# Altium schematic sheet MCU_CAN.SchDoc
size A4
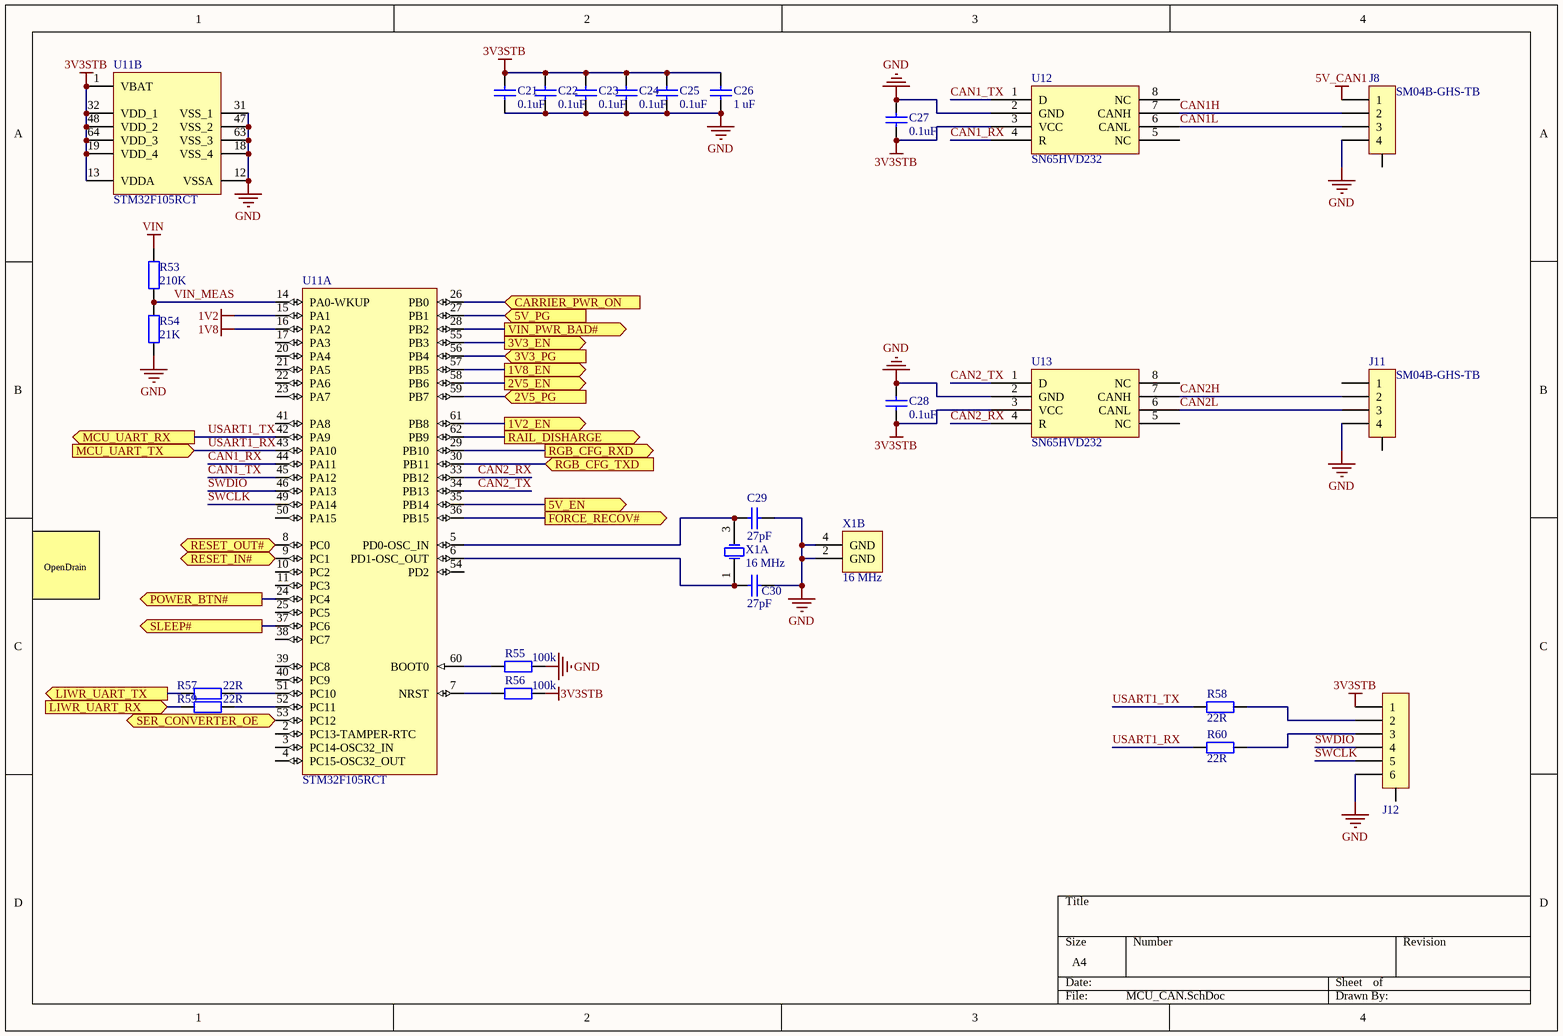
[diagram p0: MCU_CAN.SchDoc]

## Parts
C21  Capacitance: 0.1uF  [0402C_M]  (hidden comment: GRM155R71C104KA88D)
C22  Capacitance: 0.1uF  [0402C_M]  (hidden comment: GRM155R71C104KA88D)
C23  Capacitance: 0.1uF  [0402C_M]  (hidden comment: GRM155R71C104KA88D)
C24  Capacitance: 0.1uF  [0402C_M]  (hidden comment: GRM155R71C104KA88D)
C25  Capacitance: 0.1uF  [0402C_M]  (hidden comment: GRM155R71C104KA88D)
C26  Capacitance: 1 uF  [0603C_M]  (hidden comment: GRM188R61A105KA61D)
C27  Capacitance: 0.1uF  [0402C_M]  (hidden comment: GRM155R71C104KA88D)
C28  Capacitance: 0.1uF  [0402C_M]  (hidden comment: GRM155R71C104KA88D)
C29  Capacitance: 27pF  [0402C_M]  (hidden comment: GRM1555C1H270JA01D)
C30  Capacitance: 27pF  [0402C_M]  (hidden comment: GRM1555C1H270JA01D)
J8  SM04B-GHS-TB  [SM04B-GHS-TB]
J11  SM04B-GHS-TB  [SM04B-GHS-TB]
J12  SM06B-SRSS-TB(LF)(SN)  [SM06B-SRSS-TB]  (value not drawn)
R53  value 210K  [0402R_M]  (hidden comment: CRCW0402210KFKED)
R54  value 21K  [0402R_M]  (hidden comment: CRCW040221K0FKED)
R55  Resistance: 100k  [0402R_M]  (hidden comment: CRCW0402100KJNED)
R56  Resistance: 100k  [0402R_M]  (hidden comment: CRCW0402100KJNED)
R57  Resistance: 22R  [0402R_M]  (hidden comment: CRCW040222R0JNED)
R58  Resistance: 22R  [0402R_M]  (hidden comment: CRCW040222R0JNED)
R59  Resistance: 22R  [0402R_M]  (hidden comment: CRCW040222R0JNED)
R60  Resistance: 22R  [0402R_M]  (hidden comment: CRCW040222R0JNED)
U11  STM32F105RCT  [LQFP64_LD]  (parts A,B of 2)
U12  SN65HVD232  [SOIC8_L]
U13  SN65HVD232  [SOIC8_L]
X1  Frequency: 16 MHz  [TSX-3225_H]  (hidden comment: CRYS 16MHz 9pF)  (parts A,B of 2)

## Ports
1V2_EN (out), 1V8_EN (out), 2V5_EN (out), 2V5_PG (in), 3V3_EN (out), 3V3_PG (in), 5V_EN (out), 5V_PG (in), CARRIER_PWR_ON (in), FORCE_RECOV# (out), LIWR_UART_RX (in), LIWR_UART_TX (out), MCU_UART_RX (out), MCU_UART_TX (in), POWER_BTN# (out), RAIL_DISHARGE (out), RESET_IN# (out), RESET_OUT# (out), RGB_CFG_RXD (out), RGB_CFG_TXD (in), SER_CONVERTER_OE (out), SLEEP# (out), VIN_PWR_BAD# (out)

## Nets
1V2: U11.15(PA1)
1V8: U11.16(PA2)
3V3STB: C21.2 C22.2 C23.2 C24.2 C25.2 C26.2 C27.1 C28.1 J12.1 R56.2 U11.1(VBAT) U11.13(VDDA) U11.19(VDD_4) U11.32(VDD_1) U11.48(VDD_2) U11.64(VDD_3) U12.3(VCC) U13.3(VCC)
5V_CAN1: J8.1
GND: C21.1 C22.1 C23.1 C24.1 C25.1 C26.1 C27.2 C28.2 C29.2 C30.2 J8.4 J11.4 J12.6 R54.1 R55.2 U11.12(VSSA) U11.18(VSS_4) U11.31(VSS_1) U11.47(VSS_2) U11.63(VSS_3) U12.2(GND) U13.2(GND) X1.2(GND) X1.4(GND)
VIN: R53.2
1V2_EN: U11.61(PB8) ; port 1V2_EN
1V8_EN: U11.57(PB5) ; port 1V8_EN
2V5_EN: U11.58(PB6) ; port 2V5_EN
2V5_PG: U11.59(PB7) ; port 2V5_PG
3V3_EN: U11.55(PB3) ; port 3V3_EN
3V3_PG: U11.56(PB4) ; port 3V3_PG
5V_EN: U11.35(PB14) ; port 5V_EN
5V_PG: U11.27(PB1) ; port 5V_PG
CAN1_RX: U11.44(PA11) U12.4(R)
CAN1_TX: U11.45(PA12) U12.1(D)
CAN1H: J8.2 U12.7(CANH)
CAN1L: J8.3 U12.6(CANL)
CAN2_RX: U11.33(PB12) U13.4(R)
CAN2_TX: U11.34(PB13) U13.1(D)
CAN2H: J11.2 U13.7(CANH)
CAN2L: J11.3 U13.6(CANL)
CARRIER_PWR_ON: U11.26(PB0) ; port CARRIER_PWR_ON
FORCE_RECOV#: U11.36(PB15) ; port FORCE_RECOV#
LIWR_UART_RX: R59.1 ; port LIWR_UART_RX
LIWR_UART_TX: R57.1 ; port LIWR_UART_TX
POWER_BTN#: U11.24(PC4) ; port POWER_BTN#
RAIL_DISHARGE: U11.62(PB9) ; port RAIL_DISHARGE
RESET_IN#: U11.9(PC1) ; port RESET_IN#
RESET_OUT#: U11.8(PC0) ; port RESET_OUT#
RGB_CFG_RXD: U11.29(PB10) ; port RGB_CFG_RXD
RGB_CFG_TXD: U11.30(PB11) ; port RGB_CFG_TXD
SER_CONVERTER_OE: U11.53(PC12) ; port SER_CONVERTER_OE
SLEEP#: U11.37(PC6) ; port SLEEP#
SWCLK: J12.5 U11.49(PA14)
SWDIO: J12.4 U11.46(PA13)
USART1_RX: R60.1 U11.43(PA10) ; port MCU_UART_TX
USART1_TX: R58.1 U11.42(PA9) ; port MCU_UART_RX
VIN_MEAS: R53.1 R54.2 U11.14(PA0-WKUP)
VIN_PWR_BAD#: U11.28(PB2) ; port VIN_PWR_BAD#
NetC29_1: C29.1 U11.5(PD0-OSC_IN) X1.3(X2)
NetC30_1: C30.1 U11.6(PD1-OSC_OUT) X1.1(X1)
NetJ12_2: J12.2 R58.2
NetJ12_3: J12.3 R60.2
NetR55_1: R55.1 U11.60(BOOT0)
NetR56_1: R56.1 U11.7(NRST)
NetR57_2: R57.2 U11.51(PC10)
NetR59_2: R59.2 U11.52(PC11)

Not connected (* = marked no-connect by the designer): J8 0; J11 0 1; J12 0; U11 2(PC13-TAMPER-RTC) 3(PC14-OSC32_IN) 4(PC15-OSC32_OUT) 10(PC2) 11(PC3) 17(PA3) 20(PA4) 21(PA5) 22(PA6) 23(PA7) 25(PC5) 38(PC7) 39(PC8) 40(PC9) 41(PA8) 50(PA15) 54(PD2); U12 5(NC) 8(NC); U13 5(NC) 8(NC)

## Notes on the sheet
- OpenDrain

## Library data of the parts
C21-C25 C27 C28 = GRM155R71C104KA88D: CAP CER 0.1UF 16V X7R 0402; Manufacturer: Murata Electronics North America; Tolerance: ±10%; Supplier 1: Digi-Key; Manufacturer Part Number: GRM155R71C104KA88D; RoHS: RoHS Compliant; Category: Capacitors; Stock 1: 58190082; Pricing 1: 1=0.1, 10=0.013, 100=0.0059, 500=0.00422, 1000=0.00332, 2500=0.00302, 5000=0.00278 (USD); Packaging: Cut Tape (CT); ComponentLink1URL: http://www.murata.com/~/media/webrenewal/support/library/catalog/products/capacitor/mlcc/c02e.ashx; ComponentLink1Description: http://www.murata.com/~/media/webrenewal/support/library/catalog/products/capacitor/mlcc/c02e.ashx; Supplier Part Number 1: 490-3261-1-ND; Part Status: Active; Voltage - Rated: 16V; Temperature Coefficient: X7R; Operating Temperature: -55°C ~ 125°C; Features: -; Ratings: -; Applications: General Purpose; Mounting Type: Surface Mount, MLCC; Package / Case: 0402 (1005 Metric); Size / Dimension: 0.039" L x 0.020" W (1.00mm x 0.50mm); Height - Seated (Max): -; Thickness (Max): 0.022" (0.55mm); Lead Spacing: -; Lead Style: -
C26 = GRM188R61A105KA61D: CAP CER 1UF 10V X5R 0603; Manufacturer: Murata; Capacitance - nF: 1000 nF; Brand: Murata Electronics; Tolerance: 10 %; Case Height: 0.8 mm; Case Length: 1.6 mm; Temperature Coefficient / Code: +/- 15 %; Type: General Purpose MLCC; Supplier 1: Digi-Key; Manufacturer Part Number: GRM188R61A105KA61D; Stock 1: 2238936; Pricing 1: 1=0.1, 10=0.04, 100=0.0178, 500=0.0127, 1000=0.01 (USD); Dimensions: 0.8 mm W x 1.6 mm L x 0.8 mm H; Product Category: Multilayer Ceramic Capacitors MLCC - SMD/SMT; RoHS: Details; Voltage Rating DC: 10 V; Dielectric: X5R; Case Code - in: 0603; Case Code - mm: 1608; Minimum Operating Temperature: - 55 C; Maximum Operating Temperature: + 85 C; Product: General Type MLCCs; Case Width: 0.8 mm; Operating Temperature Range: - 55 C to + 85 C; Package / Case: 0603 (1608 metric); Packaging: Reel; Series: GRM; Factory Pack Quantity: 4000; Termination Style: SMD/SMT; ComponentLink1URL: https://datasheet.ciiva.com/18102/getdatasheetpartid-85467-18102910.pdf; ComponentLink1Description: https://datasheet.ciiva.com/18102/getdatasheetpartid-85467-18102910.pdf; ComponentLink2URL: https://datasheet.ciiva.com/19476/1857381-19476568.pdf; ComponentLink2Description: https://datasheet.ciiva.com/19476/1857381-19476568.pdf; ComponentLink3URL: https://datasheet.ciiva.com/131/partnumbering-e-01-131743.pdf; ComponentLink3Description: https://datasheet.ciiva.com/131/partnumbering-e-01-131743.pdf; ComponentLink4URL: https://datasheet.ciiva.com/22706/608985-22706782.pdf; ComponentLink4Description: https://datasheet.ciiva.com/22706/608985-22706782.pdf; ComponentLink5URL: https://datasheet.ciiva.com/131/partnumbering-e-01-131742.pdf; ComponentLink5Description: https://datasheet.ciiva.com/131/partnumbering-e-01-131742.pdf; ComponentLink6URL: https://datasheet.ciiva.com/7719/608985-7719036.pdf; ComponentLink6Description: https://datasheet.ciiva.com/7719/608985-7719036.pdf; ComponentLink7URL: https://datasheet.ciiva.com/16199/product-16199724.pdf; ComponentLink7Description: https://datasheet.ciiva.com/16199/product-16199724.pdf; ComponentLink8URL: https://datasheet.ciiva.com/131/partnumbering-e-01-131741.pdf; ComponentLink8Description: https://datasheet.ciiva.com/131/partnumbering-e-01-131741.pdf; Supplier Part Number 1: 490-1543-1-ND; Voltage Rating: 10 V
C29 C30 = GRM1555C1H270JA01D: Cap Ceramic 27pF 50V C0G 5% SMD 0402 125C T/R; Manufacturer: Murata; Supplier 1: Digi-Key; Manufacturer Part Number: GRM1555C1H270JA01D; Stock 1: 603221; Pricing 1: 1=0.1, 10=0.019, 100=0.0083, 500=0.0059, 1000=0.0047, 2500=0.0042, 5000=0.0039 (USD); Case Size/Dimension: 0402; Dielectric: C0G; Tolerance (%): ±5 %; Rated Voltage: 50 V; ComponentLink1URL: https://datasheet.ciiva.com/18184/getdatasheetpartid-296877-18184278.pdf; ComponentLink1Description: https://datasheet.ciiva.com/18184/getdatasheetpartid-296877-18184278.pdf; ComponentLink2URL: https://datasheet.ciiva.com/6048/1784399-6048453.pdf; ComponentLink2Description: https://datasheet.ciiva.com/6048/1784399-6048453.pdf; ComponentLink3URL: https://datasheet.ciiva.com/2989/product-2989312.pdf; ComponentLink3Description: https://datasheet.ciiva.com/2989/product-2989312.pdf; ComponentLink4URL: https://datasheet.ciiva.com/6277/partnumbering-e-01-6277819.pdf; ComponentLink4Description: https://datasheet.ciiva.com/6277/partnumbering-e-01-6277819.pdf; ComponentLink5URL: https://datasheet.ciiva.com/16440/product-16440556.pdf; ComponentLink5Description: https://datasheet.ciiva.com/16440/product-16440556.pdf; ComponentLink6URL: https://datasheet.ciiva.com/17451/product-17451565.pdf; ComponentLink6Description: https://datasheet.ciiva.com/17451/product-17451565.pdf; ComponentLink7URL: https://datasheet.ciiva.com/7828/1784399-7828854.pdf; ComponentLink7Description: https://datasheet.ciiva.com/7828/1784399-7828854.pdf; ComponentLink8URL: https://datasheet.ciiva.com/6277/partnumbering-e-01-6277817.pdf; ComponentLink8Description: https://datasheet.ciiva.com/6277/partnumbering-e-01-6277817.pdf; ComponentLink9URL: https://datasheet.ciiva.com/6277/partnumbering-e-01-6277818.pdf; ComponentLink9Description: https://datasheet.ciiva.com/6277/partnumbering-e-01-6277818.pdf; Supplier Part Number 1: 490-5869-6-ND
J8 J11 = SM04B-GHS-TB(LF)(SN)-: CONN HEADER GH SIDE 4POS 1.25MM; Manufacturer: JST Sales America Inc.; Pitch - Mating: 0.049" (1.25mm); Style: Board to Cable/Wire; Shrouding: Shrouded - 4 Wall; Number of Positions: 4; Number of Positions Loaded: All; Material Flammability Rating: UL94 V-0; Current Rating: 1A; Voltage Rating: 50V; Supplier 1: Digi-Key; Manufacturer Part Number: SM04B-GHS-TB(LF)(SN)-; RoHS: RoHS Compliant; Category: Connectors, Interconnects; Stock 1: 27537; Pricing 1: 1=0.45, 10=0.423, 100=0.3244, 500=0.28212, 1000=0.23274 (USD); Packaging: Cut Tape (CT); Part Status: Active; Connector Type: Header; Contact Type: Outer Shroud Contact; Number of Rows: 1; Row Spacing - Mating: -; Mounting Type: Surface Mount, Right Angle; Termination: Solder; Fastening Type: Locking Ramp; Contact Length - Mating: -; Contact Length - Post: -; Overall Contact Length: -; Insulation Height: 0.167" (4.25mm); Contact Shape: Rectangular; Contact Finish - Mating: Tin; Contact Finish Thickness - Mating: -; Contact Finish - Post: Tin; Contact Material: Phosphor Bronze; Insulation Material: Polyamide (PA9T), Nylon 9T; Features: Solder Retention; Operating Temperature: -25°C ~ 85°C; Ingress Protection: -; Insulation Color: Natural; Mated Stacking Heights: -; Contact Finish Thickness - Post: -; Applications: -; ComponentLink1URL: http://www.jst-mfg.com/product/pdf/eng/eGH.pdf; ComponentLink1Description: http://www.jst-mfg.com/product/pdf/eng/eGH.pdf; Supplier Part Number 1: 455-1566-1-ND
J12 = SM06B-SRSS-TB(LF)(SN): CONN HEADER SH 6POS SIDE 1MM TIN; Manufacturer: JST Sales America Inc.; Pitch - Mating: 0.039" (1.00mm); Style: Board to Cable/Wire; Shrouding: Shrouded - 4 Wall; Number of Positions: 6; Number of Positions Loaded: All; Material Flammability Rating: UL94 V-0; Current Rating: 0.7A; Voltage Rating: 50V; Mated Stacking Heights: 2.95mm; Supplier 1: Digi-Key; Manufacturer Part Number: SM06B-SRSS-TB(LF)(SN); RoHS: RoHS Compliant; Category: Connectors, Interconnects; Stock 1: 78460; Pricing 1: 1=0.83, 10=0.782, 100=0.5996, 500=0.52136, 1000=0.43013 (USD); Packaging: Cut Tape (CT); Part Status: Active; Connector Type: Header; Contact Type: Male Pin; Number of Rows: 1; Row Spacing - Mating: -; Mounting Type: Surface Mount, Right Angle; Termination: Solder; Fastening Type: Push-Pull; Contact Length - Mating: -; Contact Length - Post: -; Overall Contact Length: -; Insulation Height: 0.114" (2.90mm); Contact Shape: Square; Contact Finish - Mating: Tin; Contact Finish Thickness - Mating: -; Contact Finish - Post: Tin; Contact Material: Copper Alloy; Insulation Material: Polyamide (PA), Nylon; Features: Solder Retention; Operating Temperature: -25°C ~ 85°C; Ingress Protection: -; Insulation Color: Natural; Contact Finish Thickness - Post: -; Applications: -; ComponentLink1URL: http://www.jst-mfg.com/product/pdf/eng/eSH.pdf; ComponentLink1Description: http://www.jst-mfg.com/product/pdf/eng/eSH.pdf; Supplier Part Number 1: 455-1806-1-ND
R53 = CRCW0402210KFKED: RES SMD 210K OHM 1% 1/16W 0402; Manufacturer: Vishay Dale; Power (Watts): 0.063W, 1/16W; Temperature Coefficient: ±100ppm/°C; Supplier 1: Digi-Key; Manufacturer Part Number: CRCW0402210KFKED; RoHS: RoHS Compliant; Category: Resistors; Stock 1: 30018; Pricing 1: 1=0.1, 10=0.037, 100=0.0149, 1000=0.0067, 2500=0.00582, 5000=0.00481 (USD); Packaging: Cut Tape (CT); Part Status: Active; Tolerance: ±1%; Composition: Thick Film; Features: Automotive AEC-Q200; Operating Temperature: -55°C ~ 155°C; Package / Case: 0402 (1005 Metric); Supplier Device Package: 0402; Size / Dimension: 0.039" L x 0.020" W (1.00mm x 0.50mm); Height - Seated (Max): 0.016" (0.40mm); Failure Rate: -; ComponentLink1URL: http://www.vishay.com/docs/20035/dcrcwe3.pdf; ComponentLink1Description: http://www.vishay.com/docs/20035/dcrcwe3.pdf; Supplier Part Number 1: 541-210KLCT-ND
R54 = CRCW040221K0FKED: RES SMD 21K OHM 1% 1/16W 0402; Manufacturer: Vishay Dale; Power (Watts): 0.063W, 1/16W; Temperature Coefficient: ±100ppm/°C; Supplier 1: Digi-Key; Manufacturer Part Number: CRCW040221K0FKED; RoHS: RoHS Compliant; Category: Resistors; Stock 1: 0; Pricing 1: 1=0.1, 10=0.037, 100=0.0149, 1000=0.0067, 2500=0.00582, 5000=0.00481 (USD); Packaging: Cut Tape (CT); Part Status: Active; Tolerance: ±1%; Composition: Thick Film; Features: Automotive AEC-Q200; Operating Temperature: -55°C ~ 155°C; Package / Case: 0402 (1005 Metric); Supplier Device Package: 0402; Size / Dimension: 0.039" L x 0.020" W (1.00mm x 0.50mm); Height - Seated (Max): 0.016" (0.40mm); Failure Rate: -; ComponentLink1URL: http://www.vishay.com/docs/20035/dcrcwe3.pdf; ComponentLink1Description: http://www.vishay.com/docs/20035/dcrcwe3.pdf; Supplier Part Number 1: 541-21.0KLCT-ND
R55 R56 = CRCW0402100KJNED: RES SMD 100K OHM 5% 1/16W 0402; Manufacturer: Vishay; Brand: Vishay / Dale; Power Rating: 63 mW; Temperature Coefficient: 200 PPM / K; Voltage Rating: 50 V; Unit Weight: 0.000023 oz; Supplier 1: Digi-Key; Manufacturer Part Number: CRCW0402100KJNED; Stock 1: 174; Pricing 1: 1=0.1, 10=0.025, 100=0.01, 1000=0.0045, 2500=0.0039, 5000=0.0032 (USD); Product Category: Thick Film Resistors - SMD; RoHS: Details; Tolerance: 5 %; Case Code - in: 0402; Case Code - mm: 1005; Operating Temperature Range: - 55 C to + 155 C; Series: CRCW; Height: 0.35 mm; Length: 1 mm; Package / Case: 0402 (1005 metric); Packaging: Reel; Product: Thick Film Resistors SMD; Factory Pack Quantity: 10000; Termination Style: SMD/SMT; Width: 0.5 mm; ComponentLink1URL: https://datasheet.ciiva.com/3255/dcrcwe3-3255949.pdf; ComponentLink1Description: https://datasheet.ciiva.com/3255/dcrcwe3-3255949.pdf; ComponentLink2URL: https://datasheet.ciiva.com/28420/dcrcwe3-28420124.pdf; ComponentLink2Description: https://datasheet.ciiva.com/28420/dcrcwe3-28420124.pdf; ComponentLink3URL: https://datasheet.ciiva.com/3255/dcrcwe3-3255950.pdf; ComponentLink3Description: https://datasheet.ciiva.com/3255/dcrcwe3-3255950.pdf; ComponentLink4URL: https://datasheet.ciiva.com/28621/1847332-28621326.pdf; ComponentLink4Description: https://datasheet.ciiva.com/28621/1847332-28621326.pdf; ComponentLink5URL: https://datasheet.ciiva.com/16763/70201119-16763038.pdf; ComponentLink5Description: https://datasheet.ciiva.com/16763/70201119-16763038.pdf; ComponentLink6URL: https://datasheet.ciiva.com/2461/dcrcwe3-2461990.pdf; ComponentLink6Description: https://datasheet.ciiva.com/2461/dcrcwe3-2461990.pdf; ComponentLink7URL: https://datasheet.ciiva.com/2461/dcrcwe3-2461989.pdf; ComponentLink7Description: https://datasheet.ciiva.com/2461/dcrcwe3-2461989.pdf; ComponentLink8URL: https://datasheet.ciiva.com/2461/dcrcwe3-2461991.pdf; ComponentLink8Description: https://datasheet.ciiva.com/2461/dcrcwe3-2461991.pdf; ComponentLink9URL: https://datasheet.ciiva.com/7777/1533075-7777191.pdf; ComponentLink9Description: https://datasheet.ciiva.com/7777/1533075-7777191.pdf; ComponentLink10URL: https://datasheet.ciiva.com/5552/dcrcwe3-109170-5552439.pdf; ComponentLink10Description: https://datasheet.ciiva.com/5552/dcrcwe3-109170-5552439.pdf; Supplier Part Number 1: 541-100KJDKR-ND
R57-R60 = CRCW040222R0JNED: RES SMD 22 OHM 5% 1/16W 0402; Manufacturer: Vishay / Dale; Power Rating: 63 mW; Temperature Coefficient: 200 PPM / K; Voltage Rating: 50 V; Unit Weight: 0.000023 oz; Supplier 1: Digi-Key; Manufacturer Part Number: CRCW040222R0JNED; Stock 1: 238592; Pricing 1: 1=0.1, 10=0.025, 100=0.01, 1000=0.0045, 2500=0.0039, 5000=0.0032 (USD); Product Category: Thick Film Resistors - SMD; RoHS: Details; Brand: Vishay / Dale; Tolerance: 5 %; Case Code - in: 0402; Case Code - mm: 1005; Operating Temperature Range: - 55 C to + 155 C; Series: CRCW; Height: 0.35 mm; Length: 1 mm; Package / Case: 0402 (1005 metric); Packaging: Reel; Product: Thick Film Resistors SMD; Factory Pack Quantity: 10000; Termination Style: SMD/SMT; Width: 0.5 mm; ComponentLink1URL: https://datasheet.ciiva.com/16429/dcrcwe3-16429946.pdf; ComponentLink1Description: https://datasheet.ciiva.com/16429/dcrcwe3-16429946.pdf; ComponentLink2URL: https://datasheet.ciiva.com/8882/dcrcwe3-8882922.pdf; ComponentLink2Description: https://datasheet.ciiva.com/8882/dcrcwe3-8882922.pdf; ComponentLink3URL: https://datasheet.ciiva.com/16770/70201119-16770509.pdf; ComponentLink3Description: https://datasheet.ciiva.com/16770/70201119-16770509.pdf; ComponentLink4URL: https://datasheet.ciiva.com/3256/dcrcwe3-3256251.pdf; ComponentLink4Description: https://datasheet.ciiva.com/3256/dcrcwe3-3256251.pdf; ComponentLink5URL: https://datasheet.ciiva.com/2462/dcrcwe3-2462055.pdf; ComponentLink5Description: https://datasheet.ciiva.com/2462/dcrcwe3-2462055.pdf; ComponentLink6URL: https://datasheet.ciiva.com/7743/dcrcwe3-7743525.pdf; ComponentLink6Description: https://datasheet.ciiva.com/7743/dcrcwe3-7743525.pdf; ComponentLink7URL: https://datasheet.ciiva.com/2462/dcrcwe3-2462057.pdf; ComponentLink7Description: https://datasheet.ciiva.com/2462/dcrcwe3-2462057.pdf; ComponentLink8URL: https://datasheet.ciiva.com/2462/dcrcwe3-2462056.pdf; ComponentLink8Description: https://datasheet.ciiva.com/2462/dcrcwe3-2462056.pdf; Supplier Part Number 1: 541-22JCT-ND
U11 = STM32F105RCT: Manufacturer: STMicroelectronics; Manufacturer Part Number: STM32F105RCT6TR; Core Processor: ARM® Cortex®-M3; Core Size: 32-Bit; Speed: 72MHz; Connectivity: CAN, I²C, IrDA, LIN, SPI, UART/USART, USB OTG; Peripherals: DMA, POR, PWM, Voltage Detect, WDT; Number of I/O: 51; Program Memory Size: 256KB (256K x 8); Program Memory Type: FLASH; RAM Size: 64K x 8; Voltage - Supply (Vcc/Vdd): 2 V ~ 3.6 V; Data Converters: A/D 16x12b; D/A 2x12b; Oscillator Type: Internal; Supplier 1: Digi-Key; Supplier Part Number 1: STM32F105RCT6TR-ND; RoHS: RoHS Compliant; Category: Integrated Circuits (ICs); Stock 1: 0; Pricing 1: 1000=4.644 (USD); Packaging: Tape & Reel (TR); Part Status: Active; EEPROM Size: -; Operating Temperature: -40°C ~ 85°C (TA); Package / Case: 64-LQFP; Supplier Device Package: 64-LQFP (10x10); ComponentLink1URL: http://www.st.com/content/ccc/resource/technical/document/datasheet/e4/f3/1a/89/5a/02/46/ae/CD00220364.pdf/files/CD00220364.pdf/jcr:content/translations/en.CD00220364.pdf; ComponentLink1Description: http://www.st.com/content/ccc/resource/technical/document/datasheet/e4/f3/1a/89/5a/02/46/ae/CD00220364.pdf/files/CD00220364.pdf/jcr:content/translations/en.CD00220364.pdf
U12 U13 = SN65HVD232QDRQ1: IC 3.3V CAN TXRX 8-SOIC; Manufacturer: Texas Instruments; Number of Drivers/Receivers: 1/1; Duplex: Half; Data Rate: 1Mbps; Voltage - Supply: 3 V ~ 3.6 V; Supplier 1: Digi-Key; Manufacturer Part Number: SN65HVD232QDRQ1; RoHS: RoHS Compliant; Category: Integrated Circuits (ICs); Stock 1: 6734; Pricing 1: 1=2.43, 10=2.184, 100=1.7551, 500=1.442, 1000=1.1948 (USD); Packaging: Cut Tape (CT); Part Status: Active; Type: Transceiver; Protocol: CAN; Operating Temperature: -40°C ~ 125°C; Mounting Type: Surface Mount; Package / Case: 8-SOIC (0.154", 3.90mm Width); Supplier Device Package: 8-SOIC; ComponentLink1URL: http://www.ti.com/lit/ds/symlink/sn65hvd232q.pdf; ComponentLink1Description: http://www.ti.com/lit/ds/symlink/sn65hvd232q.pdf; Supplier Part Number 1: 296-15381-1-ND
X1 = TSX-3225 16.0000MF09Z-AC3: Crystals 16MHz 10ppm 9pF -20C +75C; Manufacturer: Epson Timing; ESR: 60 Ohms; Supplier 1: Mouser; Manufacturer Part Number: TSX-3225 16.0000MF09Z-AC3; RoHS: RoHS Compliant; Category: Crystals; Stock 1: 36861; Pricing 1: 1=0.466, 10=0.350, 100=0.311, 250=0.295, 500=0.273, 1000=0.249, 2000=0.233, 5000=0.225, 10000=0.218 (EUR); Frequency Stability: 10 PPM; Height: 0.6 mm; Length: 3.2 mm; Load Capacitance: 9 pF; Operating Temperature Range: - 20 C to + 75 C; Package / Case: 1210 (3225 metric); Packaging: Reel; Series: FA-238V/FA-238/TSX-3225; Termination Style: SMD/SMT; Tolerance: 10 PPM; Type: MHz Range Crystal Unit; Width: 2.5 mm; Brand: Epson Timing; Mounting Style: SMD/SMT; Standard Pack Qty: 1000; RoHS - Mouser: Y; Minimum Order Quantity: 1; Reeling: True; ComponentLink1URL: http://www.mouser.com/ds/2/137/1721499-465440.pdf; ComponentLink1Description: http://www.mouser.com/ds/2/137/1721499-465440.pdf; Supplier Part Number 1: 732-TX325-16F09Z-AC3